# EAGLE design RPi Power Injector (EAGLE 7.7.0)
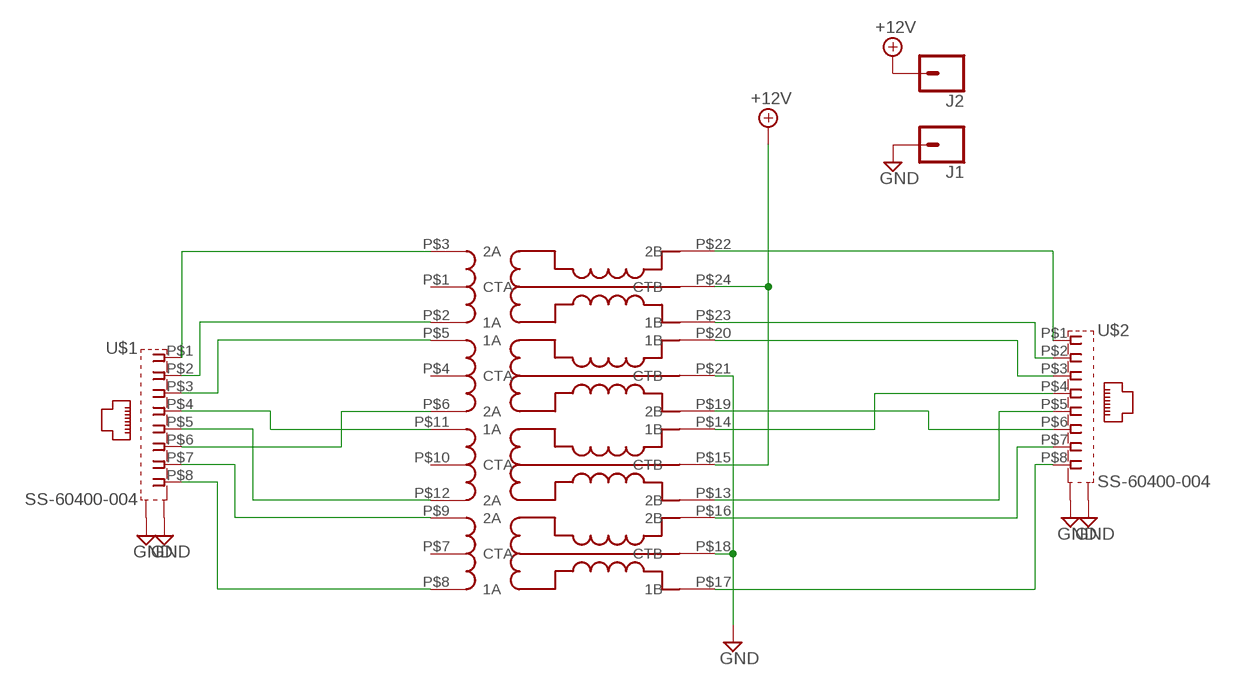
[diagram p0: schematic, sheet 1]

## Parts
J1  CONN_01  [1X01]
J2  CONN_01  [1X01]
U$1  SS-60400-004  [SS-60400-004]
U$2  SS-60400-004  [SS-60400-004]
U$3  SM51589PEL  [SOIC-24-EW]

## Nets
1A_N: U$1.P$2 U$3.P$2(1A)
1A_P: U$1.P$1 U$3.P$3(2A)
1B_N: U$2.P$2 U$3.P$23(1B)
1B_P: U$2.P$1 U$3.P$22(2B)
2A_N: U$1.P$6 U$3.P$6(2A)
2A_P: U$1.P$3 U$3.P$5(1A)
2B_N: U$2.P$6 U$3.P$19(2B)
2B_P: U$2.P$3 U$3.P$20(1B)
3A_N: U$1.P$5 U$3.P$12(2A)
3A_P: U$1.P$4 U$3.P$11(1A)
3B_N: U$2.P$5 U$3.P$13(2B)
3B_P: U$2.P$4 U$3.P$14(1B)
4A_N: U$1.P$8 U$3.P$8(1A)
4A_P: U$1.P$7 U$3.P$9(2A)
4B_N: U$2.P$8 U$3.P$17(1B)
4B_P: U$2.P$7 U$3.P$16(2B)
+12V: J2.1 U$3.P$15(CTB) U$3.P$24(CTB)
GND: J1.1 U$1.GND@1(S1) U$1.GND@2(S2) U$2.GND@1(S1) U$2.GND@2(S2) U$3.P$18(CTB) U$3.P$21(CTB)
Unconnected: U$3.P$1(CTA) U$3.P$4(CTA) U$3.P$7(CTA) U$3.P$10(CTA)

## Library data of the parts
J1 J2 = SparkFun-Connectors:CONN_01: Single connection point. Often used as Generic Header-pin footprint for 0.1 inch spaced/style header connections On any of the 0.1 inch spaced packages, you can populate with these: Break Away Headers - Straight <https://www.sparkfun.com/products/116> (PRT-00116) Break Away Male Headers - Right Angle <https://www.sparkfun.com/products/553> (PRT-00553) Female Headers <https://www.sparkfun.com/products/115> (PRT-00115) Break Away Headers - Machine Pin <https://www.sparkfun.com/products/117> (PRT-00117) Break Away Female Headers - Swiss Machine Pin <https://www.sparkfun.com/products/743> (PRT-00743) This device is also useful as a general connection point to wire up your design to another part of your project. Our various solder wires solder well into these plated through hole pads. Hook-Up Wire - Assortment (Stranded, 22 AWG) <https://www.sparkfun.com/products/11375> (PRT-11375) Hook-Up Wire - Assortment (Solid Core, 22 AWG) <https://www.sparkfun.com/products/11367> (PRT-11367) View the entire wire category on our website here <https://www.sparkfun.com/categories/141> Special notes: SMTSO-256-ET is a "flush mount" nut for a 4-40 screw. We mostly use this on specialty testbeds; it is a nice way to connect hardware to your PCB at an adjustable hieght. Also note, the SNAP packages are for using a snappable style connector. We sell a baggie of snaps and they are also used on two LilyPad designs: Snap Assortment - 30 pack (male and female) <https://www.sparkfun.com/products/11347> (DEV-11347) LilyPad Arduino SimpleSnap <https://www.sparkfun.com/products/10941> (DEV-10941) LilyPad SimpleSnap Protoboard <https://www.sparkfun.com/products/10940> (DEV-10940)
U$1 U$2 = FRC696:SS-60400-004
U$3 = FRC696:SM51589PEL

## Board
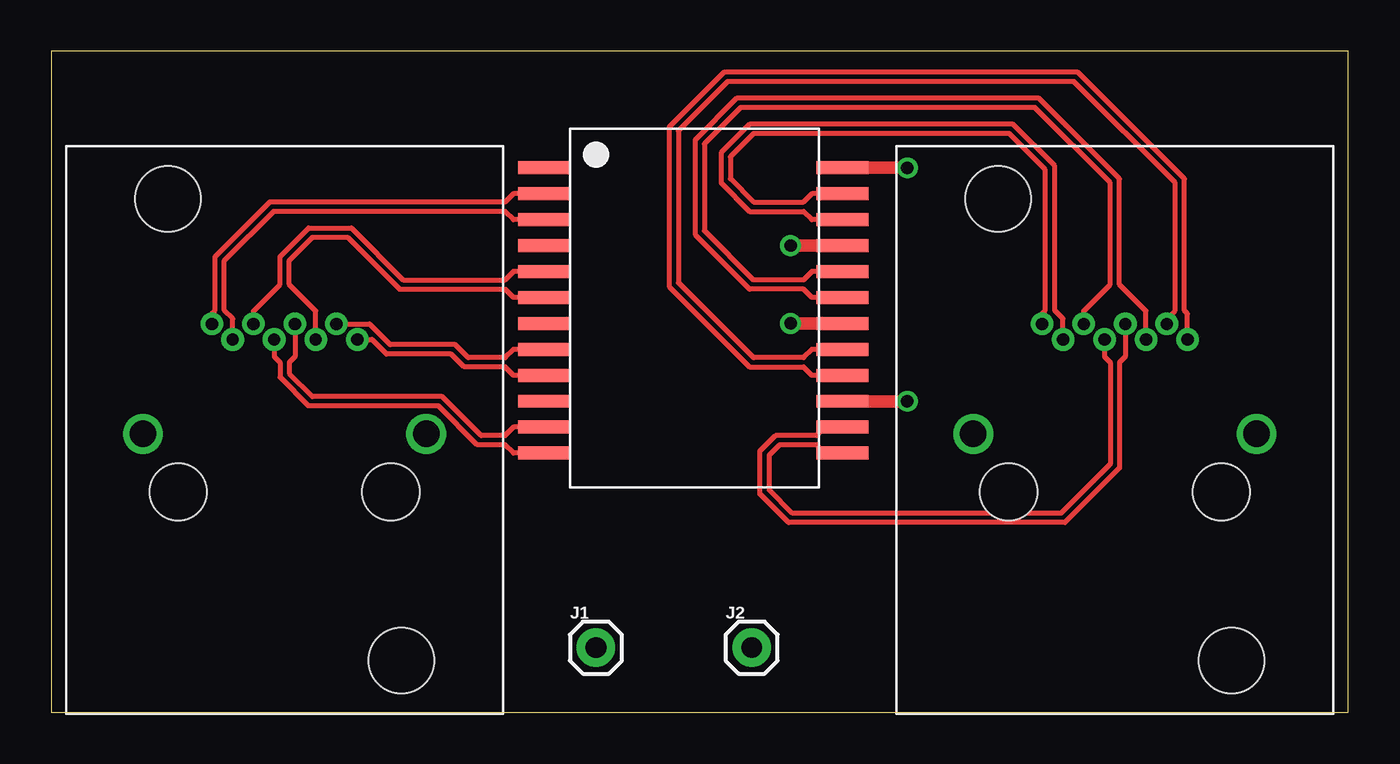
[diagram p1: board, top side]
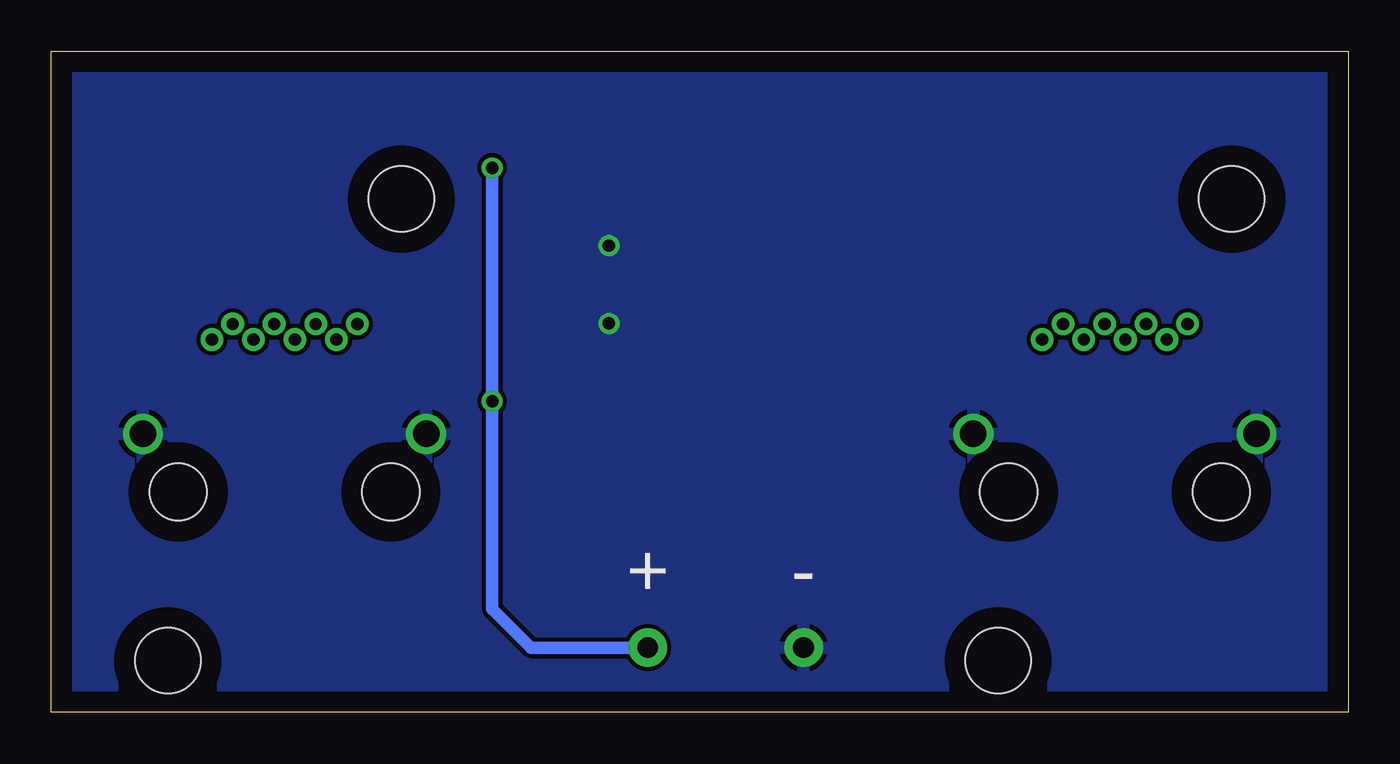
[diagram p2: board, bottom side, seen from below]

Size 63.5 x 32.39 mm. Coordinates in mm from the lower left corner, seen from the top.
Outline: 0,0 63.5,0 63.5,32.39 0,32.39 0,0
Copper layers (1*16): Top 0.035mm / dielectric 1.5mm / Bottom 0.035mm
Design rules "default": minimum track width 10mil, minimum drill 24mil, track to track 8mil, track to pad 8mil, pad to pad 8mil, via to via 8mil, smd to smd 8mil, copper to edge 40mil, drill to drill 8mil, minimum pad ring 10mil, minimum via ring 8mil, stop-mask expansion 4mil, vias tented up to drill 0mil, thermal gap 10mil

### Footprints (pad centres in the part's own frame; a part is rotated, then mirrored left to right if it is on the bottom)
1X01 = drill 1.016 pad 1.88: 1 0,0
SS-60400-004 = drill 1.3: GND@1 -6.934,2.845; GND@2 6.934,2.845 | drill 0.6: P$1 -2.54,7.468; P$2 -3.556,8.23; P$3 -1.524,8.23; P$4 0.508,8.23; P$5 -0.508,7.468; P$6 1.524,7.468; P$7 3.556,7.468; P$8 2.54,8.23 | hole 2.8: -5.207,0; 5.207,0 | hole 3.2: -5.715,14.351; 5.715,-8.255
SOIC-24-EW = smd 0.635 x 2.54: P$1 -6.985,-7.62; P$2 -5.715,-7.62; P$3 -4.445,-7.62; P$4 -3.175,-7.62; P$5 -1.905,-7.62; P$6 -0.635,-7.62; P$7 0.635,-7.62; P$8 1.905,-7.62; P$9 3.175,-7.62; P$10 4.445,-7.62; P$11 5.715,-7.62; P$12 6.985,-7.62; P$13 6.985,6.985; P$14 5.715,6.985; P$15 4.445,6.985; P$16 3.175,6.985; P$17 1.905,6.985; P$18 0.635,6.985; P$19 -0.635,6.985; P$20 -1.905,6.985; P$21 -3.175,6.985; P$22 -4.445,6.985; P$23 -5.715,6.985; P$24 -6.985,6.985

### Placement (x,y rotation side)
J1  26.67,3.17 0 top
J2  34.29,3.17 0 top
U$1  11.43,10.79 0 top
U$2  52.07,10.79 0 top
U$3  31.75,19.68 270 top

### Tracks (layer width: path | path; a pad name or v marks a point on that pad's centre or on a via)
1A_N
  Top 0.254: U$1.P$2 7.87,19.53 8.03,19.68 8.03,22.32 10.7,24.99 22.23,24.99 22.63,25.4 U$3.P$2
1A_P
  Top 0.254: U$1.P$1 8.89,19.28 8.48,19.68 8.48,22.13 10.89,24.54 22.23,24.54 22.63,24.13 U$3.P$3
1B_N
  Top 0.254: U$2.P$2 48.51,19.53 48.67,19.68 48.67,26.57 46.9,28.35 34.38,28.35 33.25,27.21 33.25,26.13 34.38,24.99 36.83,24.99 37.24,25.4 U$3.P$23
1B_P
  Top 0.254: U$2.P$1 49.53,19.28 49.12,19.68 49.12,26.76 47.09,28.8 34.2,28.8 32.79,27.4 32.79,25.94 34.2,24.54 36.83,24.54 37.24,24.13 U$3.P$22
2A_N
  Top 0.254: U$1.P$6 12.95,19.66 11.66,20.95 11.66,22.13 12.79,23.27 14.51,23.27 17.05,20.73 22.23,20.73 22.63,20.32 U$3.P$6
2A_P
  Top 0.254: U$1.P$3 9.91,19.66 11.2,20.95 11.2,22.32 12.61,23.72 14.7,23.72 17.24,21.18 22.23,21.18 22.63,21.59 U$3.P$5
2B_N
  Top 0.254: U$2.P$6 53.59,19.66 52.3,20.95 52.3,26.13 48.35,30.07 33.56,30.07 31.52,28.04 31.52,23.4 34.2,20.73 36.83,20.73 37.24,20.32 U$3.P$19
2B_P
  Top 0.254: U$2.P$3 50.55,19.66 51.84,20.95 51.84,25.94 48.16,29.62 33.75,29.62 31.98,27.84 31.98,23.59 34.38,21.18 36.83,21.18 37.24,21.59 U$3.P$20
3A_N
  Top 0.254: U$1.P$5 10.92,17.42 11.2,17.14 11.2,16.41 12.61,15.01 18.95,15.01 20.86,13.11 22.23,13.11 22.63,12.7 U$3.P$12
3A_P
  Top 0.254: U$1.P$4 11.94,17.42 11.66,17.14 11.66,16.6 12.79,15.47 19.14,15.47 21.05,13.56 22.23,13.56 22.63,13.97 U$3.P$11
3B_N
  Top 0.254: U$2.P$5 51.56,17.42 51.84,17.14 51.84,12.16 49.44,9.75 36.29,9.75 35.15,10.89 35.15,12.61 35.66,13.11 37.47,13.11 37.87,12.7 U$3.P$13
3B_P
  Top 0.254: U$2.P$4 52.58,17.42 52.3,17.14 52.3,11.97 49.62,9.3 36.1,9.3 34.7,10.7 34.7,12.79 35.47,13.56 37.47,13.56 37.87,13.97 U$3.P$14
4A_N
  Top 0.254: U$1.P$8 15.59,19.02 16.61,18.01 19.78,18.01 20.41,17.37 22.23,17.37 22.63,17.78 U$3.P$8
4A_P
  Top 0.254: U$1.P$7 15.7,18.26 16.41,17.55 19.59,17.55 20.23,16.92 22.23,16.92 22.63,16.51 U$3.P$9
4B_N
  Top 0.254: U$2.P$8 54.61,19.28 55.02,19.68 55.02,25.94 50.07,30.89 33.12,30.89 30.71,28.48 30.71,21.05 34.38,17.37 36.83,17.37 37.24,17.78 U$3.P$17
4B_P
  Top 0.254: U$2.P$7 55.63,19.53 55.47,19.68 55.47,26.13 50.26,31.34 32.92,31.34 30.25,28.67 30.25,20.86 34.2,16.92 36.83,16.92 37.24,16.51 U$3.P$16
+12V  (via drill 0.61)
  Top 0.61: U$3.P$24 v41.91,26.67 | U$3.P$15 v41.91,15.24
  Bottom 0.61: v41.91,26.67 v41.91,15.24 41.91,5.08 40.01,3.17 J2.1
GND  (via drill 0.61)
  Top 0.61: U$3.P$21 v36.2,22.86 | U$3.P$18 v36.2,19.05
  pour Bottom: -7.62,43.82 -7.62,-6.98 71.12,-6.98 71.12,43.82

### Text on the board
bPlace: - | +